# EAGLE design 1554E (EAGLE 6.5.0)
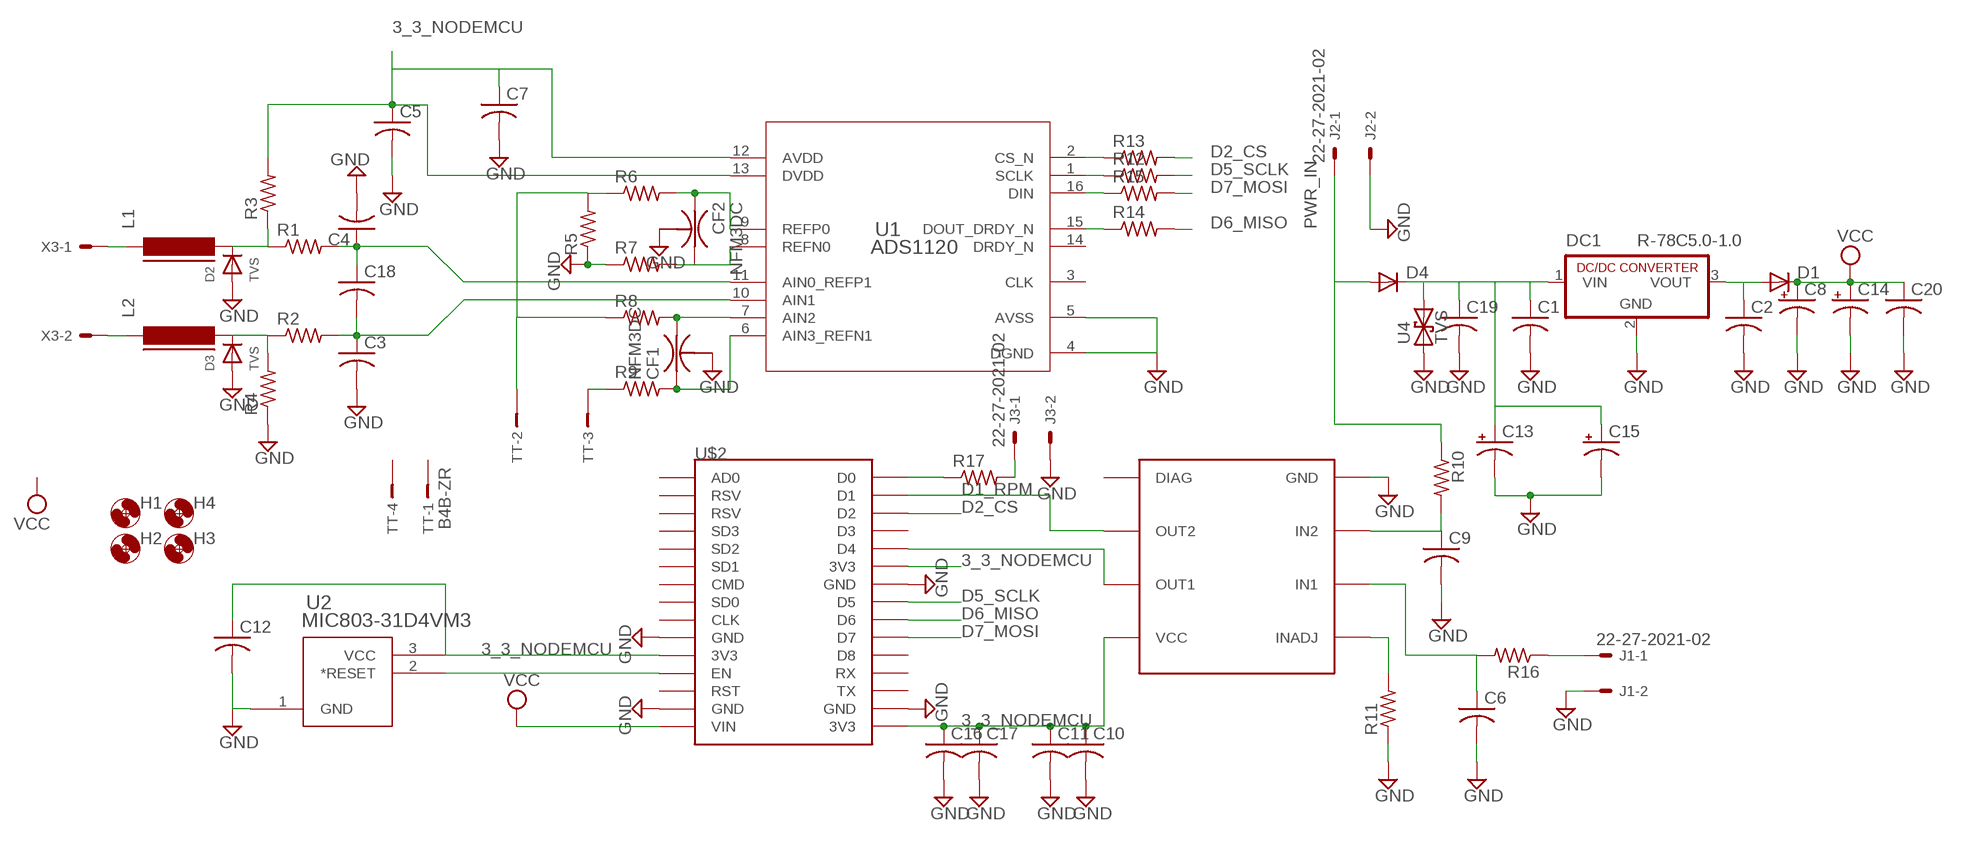
[diagram p0: schematic, sheet 1]

## Parts
C1  C-USC0805K  [C0805K]
C2  C-USC0805K  [C0805K]
C3  C-USC0805K  [C0805K]
C4  C-USC0805K  [C0805K]
C5  C-USC0805K  [C0805K]
C6  C-USC0805K  [C0805K]
C7  C-USC0805K  [C0805K]
C8  CPOL-USE2.5-5  [E2,5-5]
C9  C-USC0805K  [C0805K]
C10  C-USC0805K  [C0805K]
C11  C-USC0805K  [C0805K]
C12  C-USC0805K  [C0805K]
C13  CPOL-USE2.5-5  [E2,5-5]
C14  CPOL-USE2.5-5  [E2,5-5]
C15  CPOL-USE7.5-16  [E7,5-16]
C16  C-USC1206K  [C1206K]
C17  C-USC1206K  [C1206K]
C18  C-USC0805K  [C0805K]
C19  C-USC1206K  [C1206K]
C20  C-USC1206K  [C1206K]
CF1  NFM3DC  [NFM3DC]
CF2  NFM3DC  [NFM3DC]
D1  DIODE-DO-214AC  [DO-214AC]
D2  TVS  DIODESOD-323F  [SOD-323F]
D3  TVS  DIODESOD-323F  [SOD-323F]
D4  DIODE-DO-214AC  [DO-214AC]
DC1  R-78C5.0-1.0  [SIP3]
H1  MOUNT-HOLE2.8  [2,8]
H2  MOUNT-HOLE2.8  [2,8]
H3  MOUNT-HOLE2.8  [2,8]
H4  MOUNT-HOLE2.8  [2,8]
J1  22-27-2021-02  [6410-02]
J2  22-27-2021-02  [6410-02]
J3  22-27-2021-02  [6410-02]
L1  FERRITE-0805  [FB805]
L2  FERRITE-0805  [FB805]
R1  R-US_R0805W  [R0805W]
R2  R-US_R0805W  [R0805W]
R3  R-US_R0805W  [R0805W]
R4  R-US_R0805W  [R0805W]
R5  R-US_R0805W  [R0805W]
R6  R-US_R0805W  [R0805W]
R7  R-US_R0805W  [R0805W]
R8  R-US_R0805W  [R0805W]
R9  R-US_R0805W  [R0805W]
R10  R-US_R0805W  [R0805W]
R11  R-US_R0805W  [R0805W]
R12  R-US_R0805W  [R0805W]
R13  R-US_R0805W  [R0805W]
R14  R-US_R0805W  [R0805W]
R15  R-US_R0805W  [R0805W]
R16  R-US_R0805W  [R0805W]
R17  R-US_R0805W  [R0805W]
TT  B4B-ZR  [B4B-ZR]
U1  ADS1120  ADS1120IPWR  [PW0016A_N]
U2  MIC803-31D4VM3  [SOT-23_M3]
U4  TVS  [SMA-DIODE]
U$1  NCV1124  [TESTER]
U$2  ESP12E_DEVKIT  [ESP12E_DEVKIT]
X3  22-23-2021  [22-23-2021]

## Nets
3_3_NODEMCU: C5.1 C7.1 C10.1 C11.1 C12.1 C16.1 C17.1 R3.2 U1.12(AVDD) U1.13(DVDD) U2.3(VCC) U$1.VCC U$2.3V3@0(3V3) U$2.3V3@1(3V3) U$2.3V3@2(3V3)
D1_RPM: U$1.OUT2 U$2.D1
D2_CS: R13.2 U$2.D2
D5_SCLK: R12.2 U$2.D5
D6_MISO: R14.2 U$2.D6
D7_MOSI: R15.2 U$2.D7
GND: C1.2 C2.2 C3.2 C4.2 C5.2 C6.2 C7.2 C8.- C9.2 C10.2 C11.2 C12.2 C13.- C14.- C15.- C16.2 C17.2 C19.2 C20.2 CF1.2@1 CF2.2@1 D2.A D3.A DC1.2(GND) J1.2 J2.2 J3.2 R4.1 R5.1 R7.1 R11.1 U1.4(DGND) U1.5(AVSS) U2.1(GND) U4.A U$1.GND U$2.GND@0(GND) U$2.GND@1(GND) U$2.GND@2(GND) U$2.GND@3(GND)
N$1: L1.1 X3.1
N$2: C2.1 D1.A DC1.3(VOUT)
N$3: CF1.1 R9.2 U1.6(AIN3_REFN1)
N$4: CF2.3 R7.2 U1.8(REFN0)
N$5: D3.C L2.2 R2.1 R4.2
N$6: C4.1 C18.1 R1.2 U1.11(AIN0_REFP1)
N$7: C3.1 C18.2 R2.2 U1.10(AIN1)
N$8: D2.C L1.2 R1.1 R3.1
N$9: R11.2 U$1.INADJ
N$10: CF2.1 R6.2 U1.9(REFP0)
N$11: U2.2(*RESET) U$2.EN
N$12: CF1.3 R8.2 U1.7(AIN2)
N$13: C9.1 R10.2 U$1.IN2
N$14: L2.1 X3.2
N$15: R9.1 TT.3
N$16: R13.1 U1.2(CS_N)
N$17: J1.1 R16.1
N$18: R14.1 U1.15(DOUT_DRDY_N)
N$19: R15.1 U1.16(DIN)
N$20: R12.1 U1.1(SCLK)
N$21: C1.1 C13.+ C15.+ C19.1 D4.C DC1.1(VIN) U4.C
N$22: C6.1 R16.2 U$1.IN1
N$23: U$1.OUT1 U$2.D4
N$24: R17.1 U$2.D0
N$25: J3.1 R17.2
PWR_IN: D4.A J2.1 R10.1
REF_P: R5.2 R6.1 R8.1 TT.2
VCC: C8.+ C14.+ C20.1 D1.C U$2.VIN
Unconnected: CF1.2@2 CF2.2@2 TT.1 TT.4 U1.3(CLK) U1.14(DRDY_N) U$1.DIAG U$2.AD0 U$2.CLK U$2.CMD U$2.D3 U$2.D8 U$2.RST U$2.RSV@0(RSV) U$2.RSV@1(RSV) U$2.RX U$2.SD0 U$2.SD1 U$2.SD2 U$2.SD3 U$2.TX

## Library data of the parts
C1-C7 C9-C12 C16-C20 = adafruit:C-US: CAPACITOR, American symbol
C8 C13-C15 = adafruit:CPOL-US: POLARIZED CAPACITOR, American symbol
CF1 CF2 = murata-filter:NFM: EMIFIL(R) (Capacitor type) Single Circuit Type for Signal Lines Source: http://search.murata.co.jp/Ceramy/image/img/PDF/ENG/L0111S0109NFM3DC.pdf; MF: FARNELL; MPN: NFM3DCC470U1H3L; OC_FARNELL: 9528288; OC_NEWARK: 38K6023
D1 D4 = diode:DIODE-: DIODE
D2 D3 = adafruit:DIODE: Diode SMADIODE - SMA Surface Mount Package 20V 1A Schottky Diode Digikey: 641-1014-6-ND DO-1N4148 - Through Hole Small Current Diode SOD-123 20V 1 A (.5mV Vf) Schottky Diode - Digikey: MBRX120TPMSCT-ND SOD-323 10V 570mA (.38mV Vf, 3ns) Schottky Diode - Digikey: ZLLS410CT-ND SOD-523 30V 30mA Schottky Diode (RB751S-40TE61) - Digikey: RB751S-40TE61CT-ND SOT23-R/W - SOT23 Package (R = Solder Paste/Reflow Ovens, W = Hand-Soldering) BAT54Film 40V 300mA - Digikey: 497-7162-1-ND
DC1 = dc-dc-converter:R-78C*-1.0: INNOLINE DC/DC-Converter 1.0 AMP SIP3 Single Output Source: Data sheet <http://www.mikrocontroller.net/attachment/150645/157764-da-01-en-DC_DC_WANDLER_R_78C5_0_1_0.pdf>
H1-H4 = holes:MOUNT-HOLE: MOUNTING HOLE with drill center marker
J1-J3 = con-molex:22-?-02: CONNECTOR wire to board 2.54 mm (.1 inch) pitch header; OC_FARNELL: unknown; OC_NEWARK: unknown
L1 L2 = dp_devices:FERRITE: Ferrite bead in various packages
R1-R17 = adafruit:R-US_: RESISTOR, American symbol
TT = con-jst:?4B-ZR: ZH CONNECTOR 1.5 mm, 4 pin 1 row Source: http://www.jst.com .. eZH.pdf; MF: FARNELL; MPN: B4B-ZR(LF)(SN); OC_FARNELL: 1830916; OC_NEWARK: 37K9960
U1 = ADS1120:ADS1120IPWR; ALTERNATEPARTNUMBER: ADS1120IPW; COMPTYPE: IC; MANUFACTURER: Texas Instruments; MOUNTTYPE: SMT; PACKAGEREFERENCE: PW0016A; PARTNUMBER: ADS1120IPWR; PIN_COUNT: 16; REFDES: RefDes; ROHS: Y; TYPE: TYPE; VALUE: Value
U2 = MIC803:MIC803-31D4VM3; COPYRIGHT: Copyright (C) 2015 Accelerated Designs. All rights reserved; MANUFACTURER_PART_NUMBER: mic803-31d4vm3; VENDOR: MICREL
U4 = SparkFun-DiscreteSemi:TVS: Transient voltage suppressor- prevents ESD on inputs. Ignore package description- MBRA140 is NOT this type of part!!!
U$1 = NCV1124:NCV1124
U$2 = ESP12E_DEVKIT:ESP12E_DEVKIT: ESP12E DEVKIT BOARD
X3 = con-molex:22-23-2021: .100" (2.54mm) Center Header - 2 Pin; MF: MOLEX; MPN: 22-23-2021; OC_FARNELL: 1462926; OC_NEWARK: 25C3832

## Board
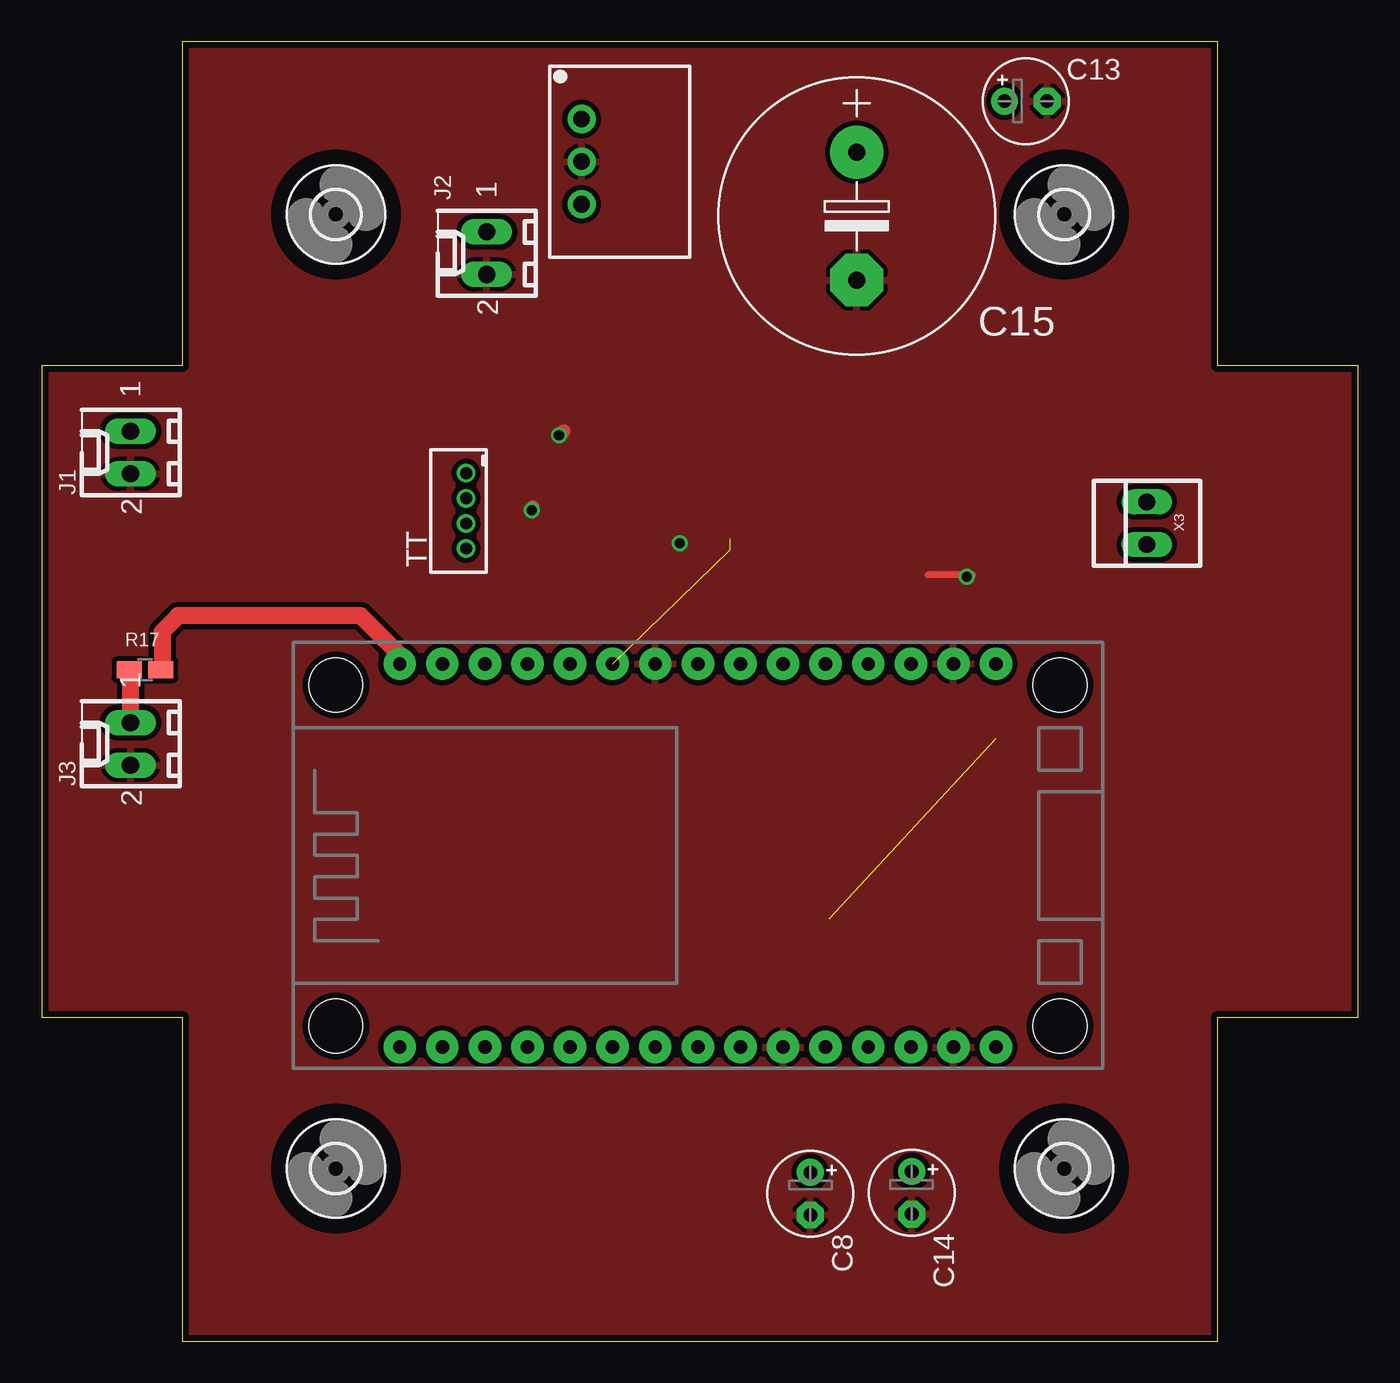
[diagram p1: board, top side]
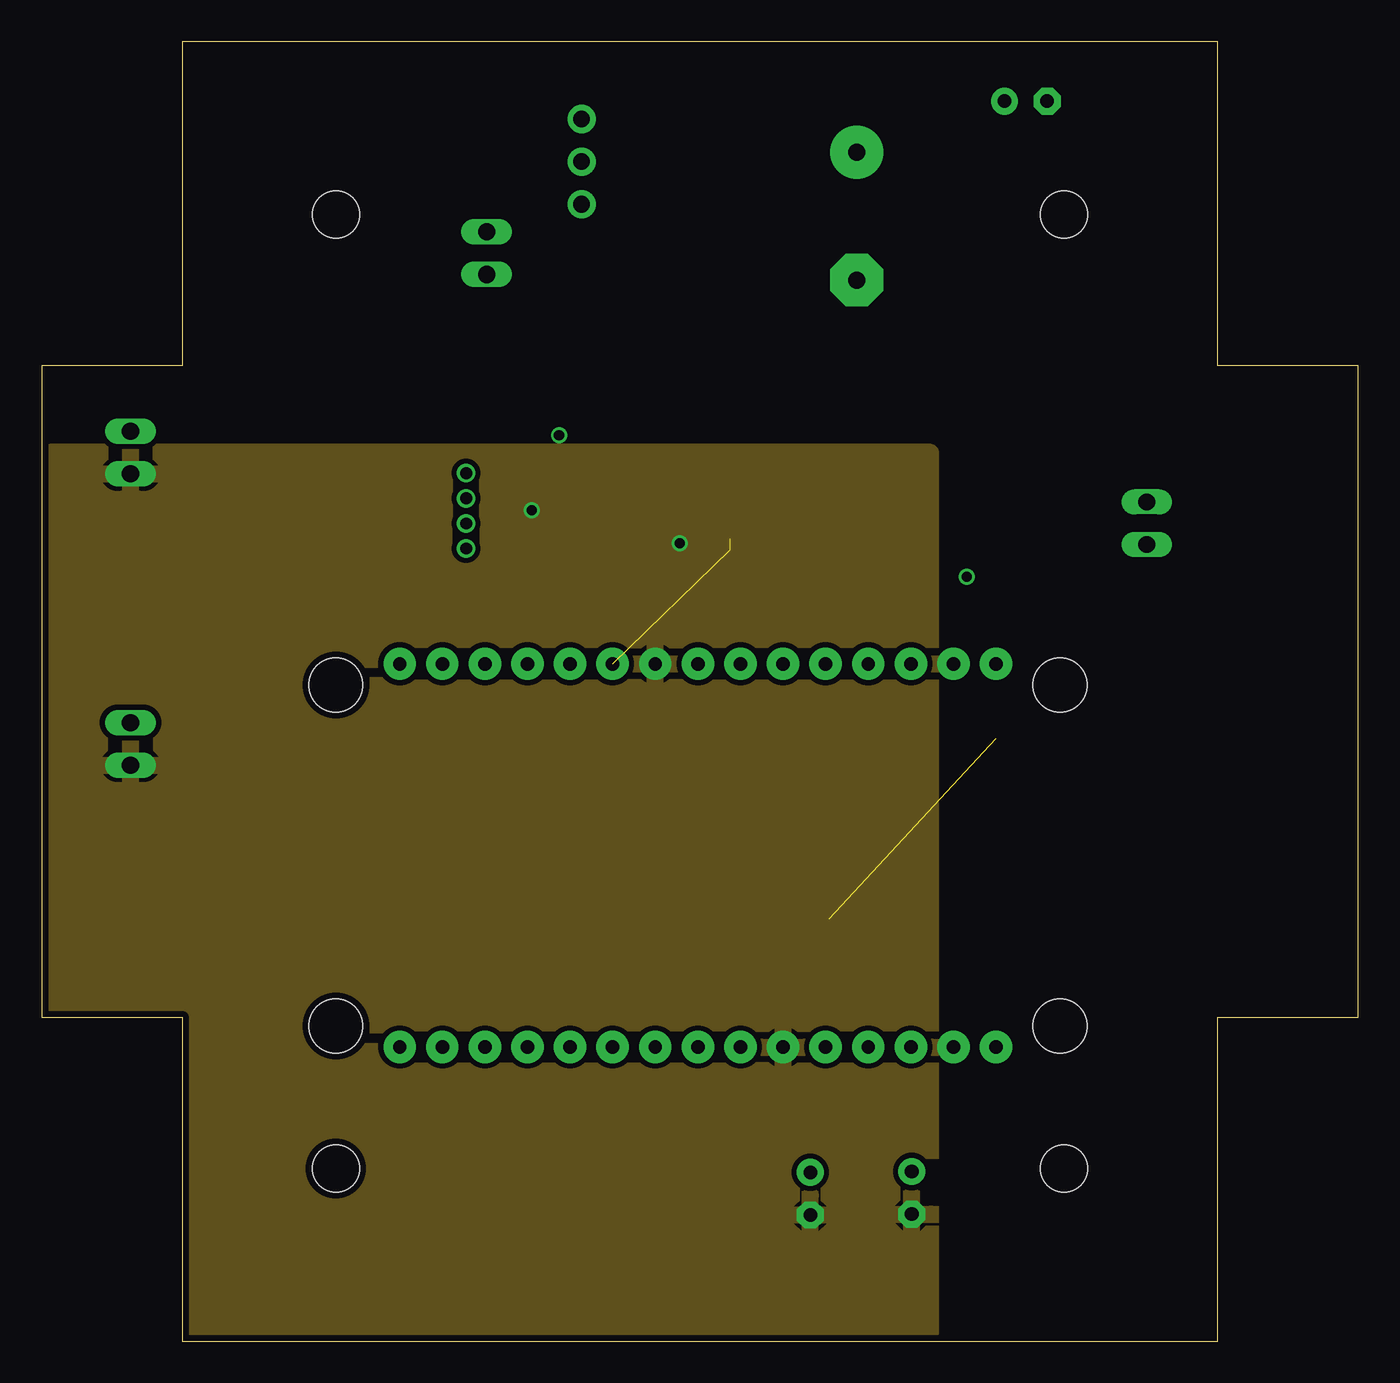
[diagram p2: board, inner layer Route2]
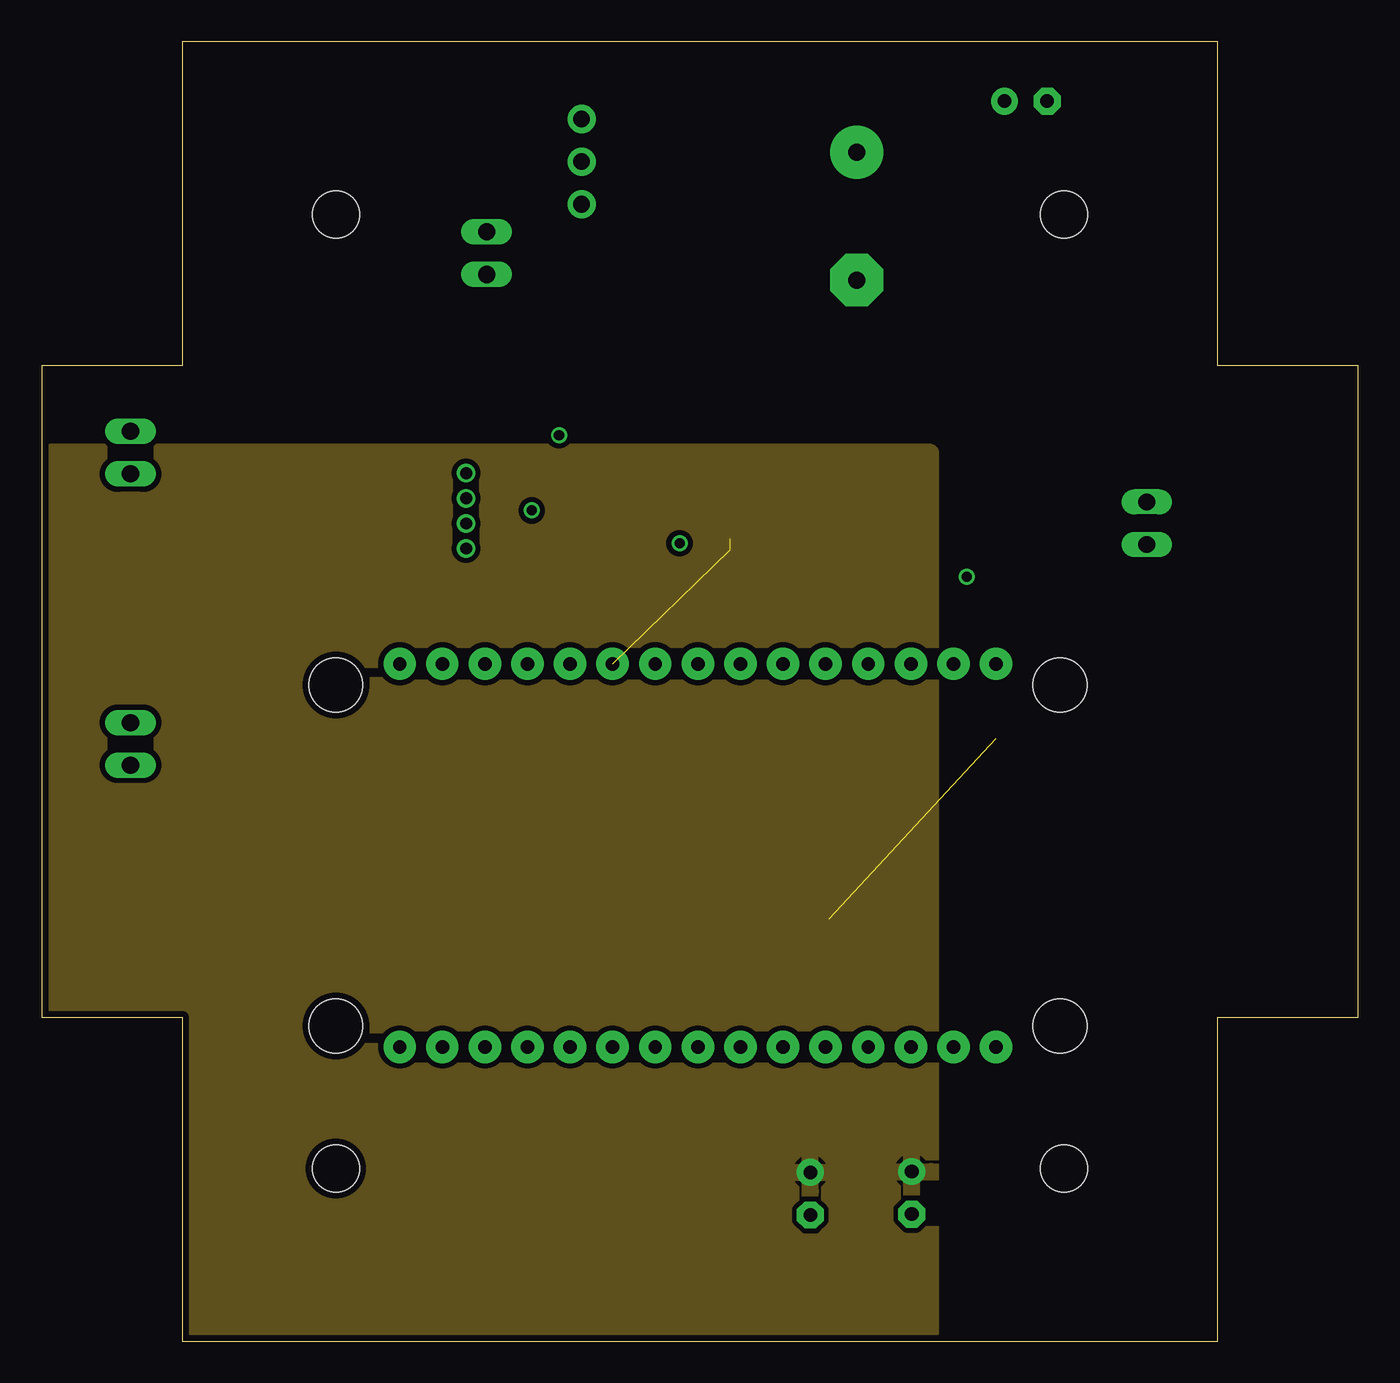
[diagram p3: board, inner layer Route15]
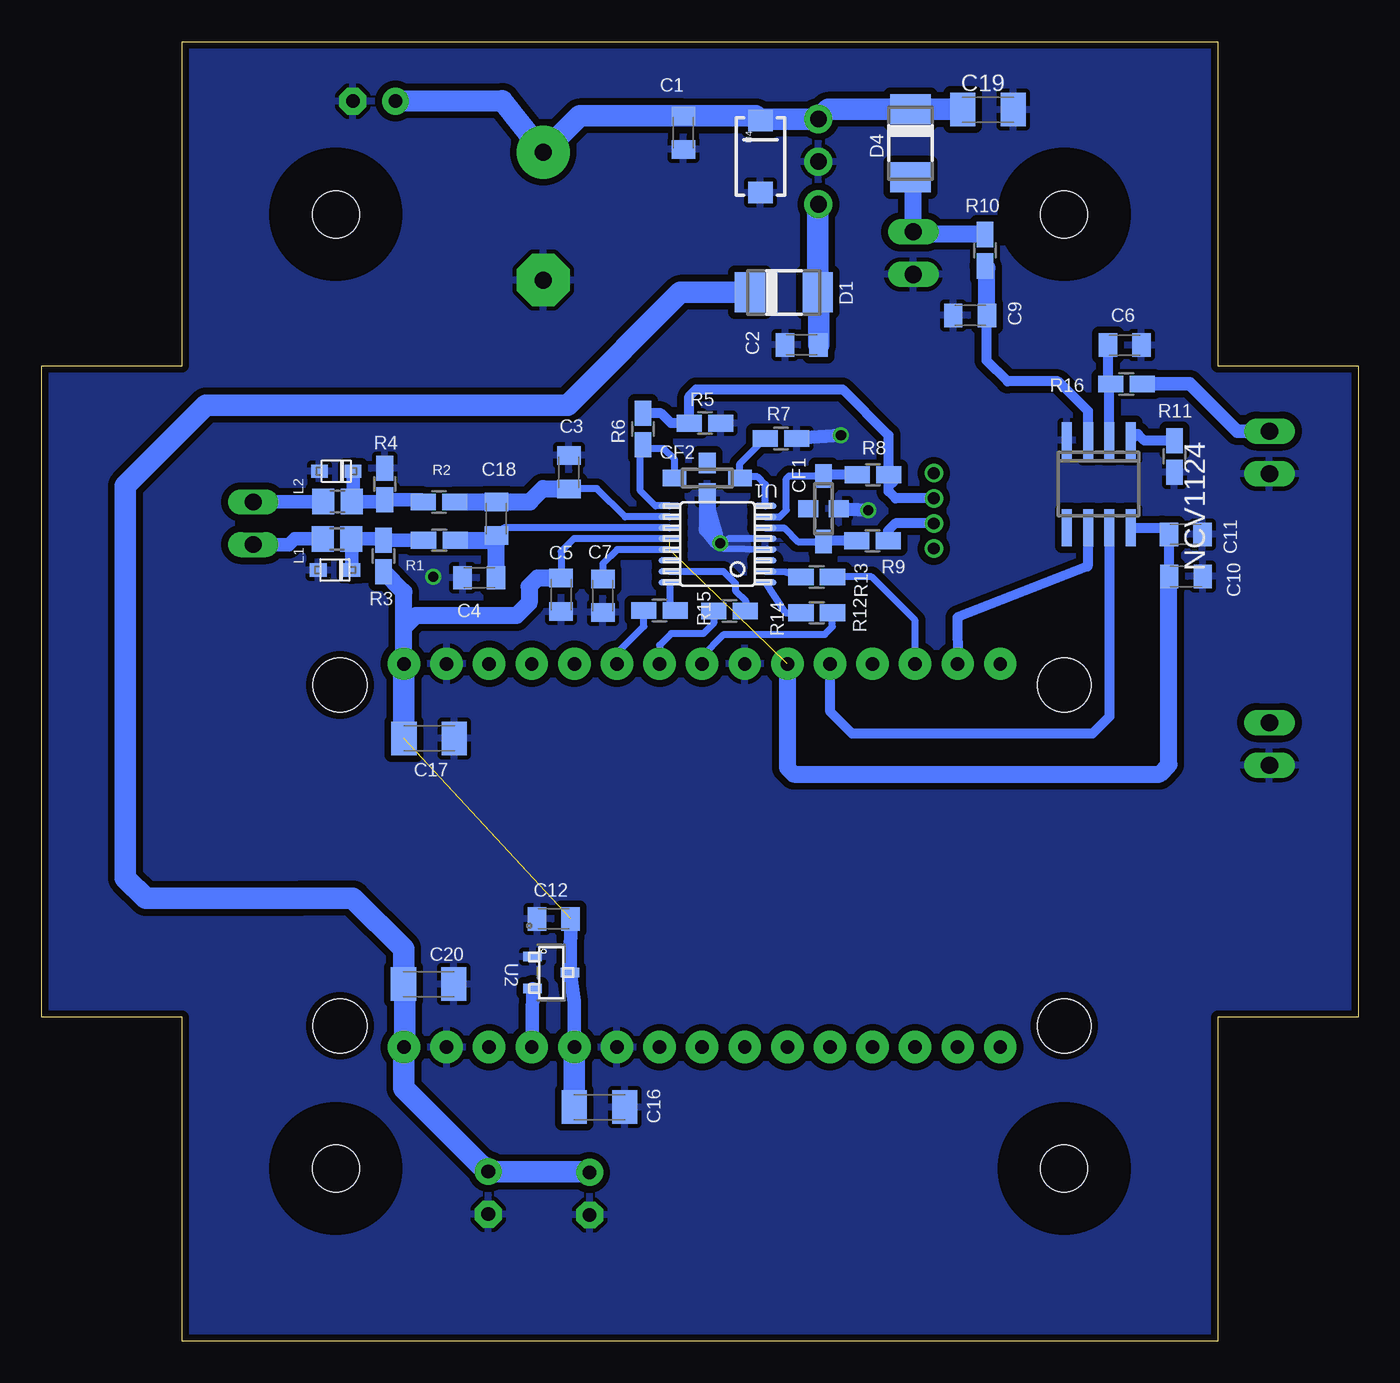
[diagram p4: board, bottom side, seen from below]

Size 78.49 x 77.47 mm. Coordinates in mm from the lower left corner, seen from the top.
Outline: 0,19.3 8.38,19.3 8.38,0 70.1,0 70.1,19.3 78.49,19.3 78.49,58.17 70.1,58.17 70.1,77.47 8.38,77.47 8.38,58.17 0,58.17 0,19.3
Copper layers (1*16): Top 0.0356mm / dielectric 1.5011mm / Bottom 0.0356mm
Design rules "default": minimum track width 6mil, minimum drill 13mil, track to track 6mil, track to pad 6mil, pad to pad 6mil, via to via 6mil, smd to smd 6mil, copper to edge 15mil, drill to drill 6mil, minimum pad ring 7mil, minimum via ring 7mil, stop-mask expansion 4mil, vias tented up to drill 0mil, thermal gap 10mil

### Footprints (pad centres in the part's own frame; a part is rotated, then mirrored left to right if it is on the bottom)
C0805K = smd 1.1 x 1.4: 1 -1,0; 2 1,0
E2,5-5 = drill 0.813 pad 1.6: + -1.27,0 | drill 0.813 pad 1.6 octagon: - 1.27,0
E7,5-16 = drill 1.016 pad 3.15: + -3.81,0 | drill 1.016 pad 3.15 octagon: - 3.81,0
C1206K = smd 1.5 x 2: 1 -1.5,0; 2 1.5,0
NFM3DC = smd 1.4 x 1: 1 -1.95,0; 3 1.95,0 | smd 1 x 1.2: 2@1 0,-0.9; 2@2 0,0.9
DO-214AC = smd 1.8 x 2.4: A 2.025,0; C -2.025,0
SOD-323F = smd 1 x 0.8: A -1,0; C 1,0
SIP3 = drill 1 pad 1.676: 1 -2.54,0; 2 0,0; 3 2.54,0
2,8 = hole 2.8: 0,0
6410-02 = drill 1.016 long: 1 1.27,0; 2 -1.27,0
FB805 = smd 1.3 x 1.5: 1 -0.85,0; 2 0.85,0
R0805W = smd 1.5 x 1: 1 -0.94,0; 2 0.94,0
B4B-ZR = drill 0.7 pad 1.1: 1 -2.25,0; 2 -0.75,0; 3 0.75,0; 4 2.25,0
PW0016A_N = smd 1.35 x 0.35: 1 -2.85,2.275; 2 -2.85,1.625; 3 -2.85,0.975; 4 -2.85,0.325; 5 -2.85,-0.325; 6 -2.85,-0.975; 7 -2.85,-1.625; 8 -2.85,-2.275; 9 2.85,-2.275; 10 2.85,-1.625; 11 2.85,-0.975; 12 2.85,-0.325; 13 2.85,0.325; 14 2.85,0.975; 15 2.85,1.625; 16 2.85,2.275
SOT-23_M3 = smd 0.559 x 1.118: 1 -0.95,-1.118; 2 0.95,-1.118; 3 0,1.118
SMA-DIODE = smd 1.27 x 1.47: A -2.15,0; C 2.15,0
TESTER = smd 0.6 x 2.2: DIAG 1.905,2.6; GND 1.905,-2.6; IN1 -0.635,-2.6; IN2 0.635,-2.6; INADJ -1.905,-2.6; OUT1 -0.635,2.6; OUT2 0.635,2.6; VCC -1.905,2.6
ESP12E_DEVKIT = drill 0.8 pad 1.93: 3V3@0 -11.43,-7.62; 3V3@1 11.43,5.08; 3V3@2 11.43,-17.78; AD0 -11.43,17.78; CLK -11.43,-2.54; CMD -11.43,2.54; D0 11.43,17.78; D1 11.43,15.24; D2 11.43,12.7; D3 11.43,10.16; D4 11.43,7.62; D5 11.43,0; D6 11.43,-2.54; D7 11.43,-5.08; D8 11.43,-7.62; EN -11.43,-10.16; GND@0 -11.43,-5.08; GND@1 -11.43,-15.24; GND@2 11.43,2.54; GND@3 11.43,-15.24; RST -11.43,-12.7; RSV@0 -11.43,15.24; RSV@1 -11.43,12.7; RX 11.43,-10.16; SD0 -11.43,0; SD1 -11.43,5.08; SD2 -11.43,7.62; SD3 -11.43,10.16; TX 11.43,-12.7; VIN -11.43,-17.78 | hole 3.2: -10.16,21.59; 10.16,21.59; 10.16,-21.59; -10.16,-21.59
22-23-2021 = drill 1 long: 1 -1.27,0; 2 1.27,0

### Placement (x,y rotation side)
C1  40.23,72.06 270 bottom
C2  33.17,59.41 180 bottom
C3  47.07,51.82 90 bottom
C4  52.4,45.52 180 bottom
C5  47.52,44.5 270 bottom
C6  13.92,59.39 0 bottom
C7  45.03,44.45 270 bottom
C8  45.82,8.79 270 top
C9  23.14,61.16 180 bottom
C10  10.26,45.59 0 bottom
C11  10.29,48.11 0 bottom
C12  47.96,25.17 180 bottom
C13  58.67,73.94 0 top
C14  51.87,8.84 270 top
C15  48.59,67.08 270 top
C16  45.24,13.94 0 bottom
C17  55.4,35.94 0 bottom
C18  51.38,49.05 90 bottom
C19  22.07,73.43 0 bottom
C20  55.42,21.29 0 bottom
CF1  31.88,49.63 90 bottom
CF2  38.81,51.46 0 bottom
D1  34.24,62.53 0 bottom
D2  61.01,45.97 0 bottom
D3  60.93,51.87 0 bottom
D4  26.7,71.42 270 bottom
DC1  32.18,70.33 270 top
H1  17.53,67.18 0 top
H2  17.53,10.29 0 top
H3  60.96,67.18 0 top
H4  60.96,10.29 0 top
J1  5.28,52.98 90 top
J2  26.52,64.87 90 top
J3  5.28,35.61 90 top
L1  60.88,47.83 0 bottom
L2  60.86,50.06 0 bottom
R1  54.79,47.75 0 bottom
R2  54.81,50.04 0 bottom
R3  58.12,46.81 270 bottom
R4  58.04,51.1 270 bottom
R5  38.94,54.74 180 bottom
R6  42.65,54.38 270 bottom
R7  34.42,53.82 180 bottom
R8  28.93,51.66 180 bottom
R9  28.96,47.73 180 bottom
R10  22.25,65.05 270 bottom
R11  10.95,52.76 90 bottom
R12  32.28,43.43 0 bottom
R13  32.28,45.57 0 bottom
R14  37.49,43.54 180 bottom
R15  41.66,43.56 180 bottom
R16  13.82,57.07 180 bottom
R17  6.15,40.03 180 top
TT  25.3,49.5 270 top
U1  38.2,47.52 180 bottom
U2  48.11,21.97 270 bottom
U4  35.64,70.64 90 bottom
U$1  15.47,51.1 180 bottom
U$2  39.12,28.96 90 top
X3  65.89,48.77 90 top

### Tracks (layer width: path | path; a pad name or v marks a point on that pad's centre or on a via)
3_3_NODEMCU  (3 unrouted)
  Bottom 0.406: U1.12 46.77,47.85 47.52,47.09 C5.1 | U1.13 44.19,47.2 45.03,46.35 C7.1
  Bottom 0.61: U$1.VCC 11.68,48.51 C11.1 11.26,48.08 C10.1
  Bottom 0.813: C12.1 46.99,22.67 U2.3 46.74,20.22 U$2.3V3@0
  Bottom 1.016: U$2.3V3@1 34.04,34.19 33.66,33.81 11.84,33.81 11.28,34.37 11.28,45.58 C10.1 | U$2.3V3@2 56.9,42.55 | 56.9,42.55 56.9,44.65 R3.2 | C5.1 48.94,45.5 49.43,45.01 49.43,44.02 50.19,43.26 56.19,43.26 56.9,42.55
  Bottom 1.27: U$2.3V3@0 C16.1 | U$2.3V3@2 C17.1
D1_RPM
  Bottom 0.61: U$1.OUT2 16.13,46.2 23.9,43.16 U$2.D1
D2_CS
  Bottom 0.406: U$2.D2 26.42,42.98 29.01,45.57 R13.2
D5_SCLK
  Bottom 0.406: U$2.D5 39.12,40.84 37.82,42.14 31.8,42.14 31.34,42.6 R12.2
D6_MISO
  Bottom 0.406: R14.2 38.43,42.8 39.04,42.19 40.97,42.19 41.66,41.5 U$2.D6
D7_MOSI
  Bottom 0.406: U$2.D7 44.2,41.02 42.6,42.62 R15.2 | R15.2
GND  (via drill 0.6)
  Top 0.406: 55.5,45.7 52.83,45.7
  Top 0.813: v30.84,54.03 31.11,54.25 | v29.21,49.53 29.26,49.71 29.13,49.53
  Bottom 0.406: U1.5 37.52,47.85 | CF2.2@1 37.85,47.27 35.26,47.22
  Bottom 0.813: R7.1 v30.84,54.03 | CF1.2@1 v29.21,49.53
  Bottom 1.016: CF2.2@1 38.81,48.44 38.2,47.7
  other vias: 38.02,47.57 55.14,45.57
  pour Route2 (isolate 0.305): 0.51,0.51 53,0.51 53,53 0.51,53
  pour Top (isolate 0.305, rank 2): 0.08,19.13 8.31,19.28 8.41,0 70.05,0.1 70.05,19.25 78.56,19.2 78.56,57.99 70.1,58.04 70.1,77.53 8.38,77.43 8.36,58.12 -0.1,58.06
  pour Bottom (isolate 0.406): -0.1,19.35 8.46,19.2 8.51,0.1 69.95,0.18 69.98,19.15 78.33,19.51 78.33,58.17 70.1,58.17 69.95,77.56 8.51,77.38 8.41,58.12 0.08,58.12
N$1
  Bottom 0.813: X3.1 63.75,47.5 63.42,47.83 L1.1
N$2
  Bottom 1.27: C2.1 32.17,62.49 D1.A 32.21,67.76 DC1.3
N$3
  Bottom 0.406: U1.6 34.22,48.5 33.4,47.68 CF1.1
  Bottom 0.61: R9.2 31.83,47.73 CF1.1
N$4
  Bottom 0.406: U1.8 35.35,51.07 35.81,51.54 36.78,51.54 CF2.3 36.86,52.32 R7.2
N$5
  Bottom 0.813: D3.C 59.94,50.14 L2.2 58.14,50.06 R4.2 55.88,50.16 R2.1
N$6
  Bottom 0.406: U1.11 50.93,48.5 C18.1
  Bottom 1.016: C4.1 51.4,48.03 C18.1 51.68,47.75 R1.2
N$7
  Bottom 0.406: U1.10 43.71,49.15 45.39,50.83 47.06,50.83 C3.1
  Bottom 1.016: R2.2 51.39,50.04 C18.2 49.39,50.05 48.62,50.83 C3.1
N$8
  Bottom 0.813: R3.1 58.19,47.83 L1.2 60.01,47.8 D2.C | R1.1 R3.1 | R3.1
N$9
  Bottom 0.61: R11.2 12.75,53.7 13.13,54.08 13.19,54.08 U$1.INADJ
N$10
  Bottom 0.406: CF2.1 40.76,52.57 41.4,53.21 42.42,53.21 R6.2 42.8,53.29 42.8,50.7 41.9,49.8 U1.9
N$11
  Bottom 0.813: U$2.EN U2.2
N$12
  Bottom 0.406: U1.7 34.49,49.15 34.09,49.55 34.09,51.44 33.93,51.59 CF1.3
  Bottom 0.61: R8.2 31.8,51.66 CF1.3
N$13
  Bottom 0.61: U$1.IN2 16.1,55.45 17.88,57.23 20.9,57.23 22.15,58.47 C9.1
  Bottom 1.016: C9.1 22.14,64 R10.2
N$14
  Bottom 0.813: X3.2 61.73,50.04 L2.1
N$15
  Bottom 0.61: TT.3 27.6,48.76 28.04,48.31 28.04,47.75 R9.1
N$16
  Bottom 0.406: U1.2 34.14,45.87 R13.1
N$17
  Bottom 0.813: R16.1 10.03,57.07 7.21,54.25 J1.1
N$18
  Bottom 0.406: U1.15 37.85,45.9 37.13,45.19 37.13,44.76 36.52,44.15 36.52,43.56 R14.1
N$19
  Bottom 0.406: U1.16 41.05,43.9 R15.1
N$20
  Bottom 0.406: U1.1 34.16,43.43 R12.1
N$21
  Bottom 1.27: C13.+ 51.03,73.97 C15.+ 46.42,73.06 C1.1 35.91,73.06 U4.C 35.55,72.87 DC1.1 31.61,73.45 D4.C 23.59,73.45 C19.1
N$22
  Bottom 0.61: U$1.IN1 14.83,57 R16.2 14.92,57.23 C6.1
N$23
  Bottom 0.61: U$1.OUT1 14.83,37.24 15.85,36.22 30.18,36.22 31.47,37.52 31.47,40.36 U$2.D4
N$24
  Top 1.016: U$2.D0 21.34,40.92 19,43.26 8.13,43.26 7.16,42.29 7.16,40.11 R17.1
N$25
  Top 1.016: J3.1 5.28,39.95 R17.2
PWR_IN
  Bottom 1.016: D4.A 26.52,69.22 J2.1 26.36,65.99 R10.1
REF_P
  Bottom 0.61: TT.2 27.57,50.26 27.99,50.67 R8.1 27.74,51.41 27.74,51.21 28.02,51.49 28.02,54.03 30.73,56.74 39.47,56.74 39.88,56.34 R5.2 40.97,54.74 41.55,55.32 R6.1
VCC
  Bottom 1.27: D1.C 40.41,62.53 47.14,55.8 68.71,55.8 73.51,51 73.51,27.61 72.29,26.39 63.07,26.39 63.04,26.42 59.94,26.42 56.92,23.39 C20.1 56.84,21.21 56.84,17.58 U$2.VIN 56.9,15.09 52.27,10.46 52.22,10.46 C14.+ 45.87,10.11 C8.+
  pour Route15 (isolate 0.305): 0.51,0.51 53,0.51 53,53 0.51,53